# EAGLE design equaliser_TDA7418 (EAGLE 7.6.0)
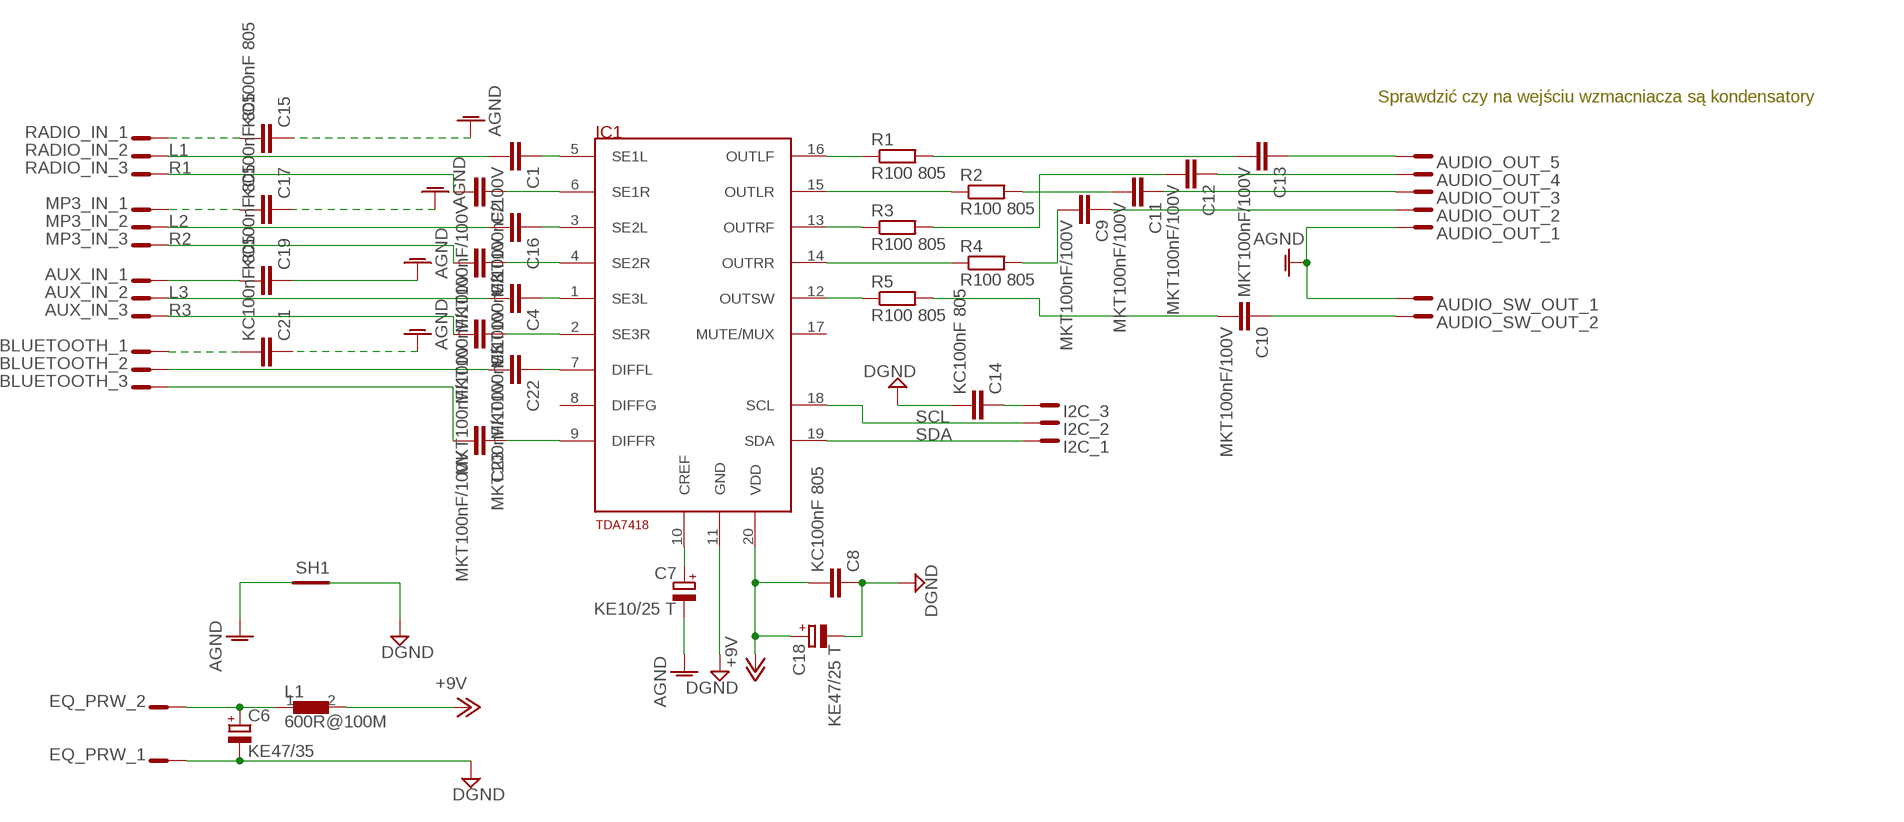
[diagram p0: schematic, sheet 1]

## Parts
AUDIO_OUT  JST_5_PIN_B5B-PH-KS  [B5B-PH-KS]
AUDIO_SW_OUT  JST_2_PIN_B2B-PH-KS  [B2B-PH-KS]
AUX_IN  JST_3_PIN_B3B-PH-KS  [B3B-PH-KS]
BLUETOOTH  JST_3_PIN_B3B-PH-KS  [B3B-PH-KS]
C1  MKT100nF/100V  C-EU050-035X075  [C050-035X075]
C2  MKT100nF/100V  C-EU050-035X075  [C050-035X075]
C3  MKT100nF/100V  C-EU050-035X075  [C050-035X075]
C4  MKT100nF/100V  C-EU050-035X075  [C050-035X075]
C5  MKT100nF/100V  C-EU050-035X075  [C050-035X075]
C6  KE47/35  CPOL-EUTT2D6  [TT2D6]
C7  KE10/25 T  CPOL-EUE1.8-4  [E1,8-4]
C8  KC100nF 805  C-EUC0805  [C0805]
C9  MKT100nF/100V  C-EU050-035X075  [C050-035X075]
C10  MKT100nF/100V  C-EU050-035X075  [C050-035X075]
C11  MKT100nF/100V  C-EU050-035X075  [C050-035X075]
C12  MKT100nF/100V  C-EU050-035X075  [C050-035X075]
C13  MKT100nF/100V  C-EU050-035X075  [C050-035X075]
C14  KC100nF 805  C-EUC0805  [C0805]
C15  KC100nF 805  C-EUC0805  [C0805]
C16  MKT100nF/100V  C-EU050-035X075  [C050-035X075]
C17  KC100nF 805  C-EUC0805  [C0805]
C18  KE47/25 T  CPOL-EUB45181B  [B45181B]
C19  KC100nF 805  C-EUC0805  [C0805]
C21  KC100nF 805  C-EUC0805  [C0805]
C22  MKT100nF/100V  C-EU050-035X075  [C050-035X075]
C23  MKT100nF/100V  C-EU050-035X075  [C050-035X075]
EQ_PRW  JST_2_PIN_B2B-XH-A  [B2B-XH-A]
I2C  JST_3_PIN_B3B-PH-KS  [B3B-PH-KS]
IC1  TDA7418  [SO20]
L1  600R@100M  FERRITR0805  [R0805]
MP3_IN  JST_3_PIN_B3B-PH-KS  [B3B-PH-KS]
R1  R100 805  R-EU_R0805  [R0805]
R2  R100 805  R-EU_R0805  [R0805]
R3  R100 805  R-EU_M0805  [M0805]
R4  R100 805  R-EU_M0805  [M0805]
R5  R100 805  R-EU_R0805  [R0805]
RADIO_IN  JST_3_PIN_B3B-PH-KS  [B3B-PH-KS]
SH1  SHORT-HT5  [SHORT_TOP-50]

## Nets
+9V0: C8.2 C18.+ IC1.20(VDD) L1.2 ; supply symbol labelled +9V
AGND: AUDIO_OUT.P$1 AUDIO_SW_OUT.P$1 C7.- C15.1 C17.1 C19.1 C21.1 SH1.1
DGND: C6.- C8.1 C14.2 C18.- EQ_PRW.P$1 IC1.11(GND) SH1.2
L1: C1.2 RADIO_IN.P$2
L2: C16.2 MP3_IN.P$2
L3: AUX_IN.P$2 C4.2
N$1: C6.+ EQ_PRW.P$2 L1.1
N$2: AUDIO_OUT.P$2 C9.1
N$3: C7.+ IC1.10(CREF)
N$4: C1.1 IC1.5(SE1L)
N$5: C2.1 IC1.6(SE1R)
N$6: C16.1 IC1.3(SE2L)
N$7: C3.1 IC1.4(SE2R)
N$8: C4.1 IC1.1(SE3L)
N$9: C5.1 IC1.2(SE3R)
N$10: C10.2 R5.2
N$11: AUDIO_SW_OUT.P$2 C10.1
N$12: IC1.16(OUTLF) R1.1
N$13: IC1.15(OUTLR) R2.1
N$14: C12.2 R3.2
N$15: C11.2 R2.2
N$16: IC1.13(OUTRF) R3.1
N$17: C9.2 R4.2
N$18: IC1.14(OUTRR) R4.1
N$19: IC1.12(OUTSW) R5.1
N$20: AUDIO_OUT.P$3 C11.1
N$21: AUDIO_OUT.P$4 C12.1
N$22: AUDIO_OUT.P$5 C13.1
N$23: C14.1 I2C.P$3
N$24: C15.2 RADIO_IN.P$1
N$25: C13.2 R1.2
N$26: C17.2 MP3_IN.P$1
N$27: AUX_IN.P$1 C19.2
N$29: BLUETOOTH.P$1 C21.2
N$30: C22.1 IC1.7(DIFFL)
N$31: C23.1 IC1.9(DIFFR)
N$32: BLUETOOTH.P$2 C22.2
N$33: BLUETOOTH.P$3 C23.2
R1: C2.2 RADIO_IN.P$3
R2: C3.2 MP3_IN.P$3
R3: AUX_IN.P$3 C5.2
SCL: I2C.P$2 IC1.18(SCL)
SDA: I2C.P$1 IC1.19(SDA)
Unconnected: IC1.8(DIFFG) IC1.17(MUTE/MUX)

## Notes on the sheet
- Sprawdzić czy na wejściu wzmacniacza są kondensatory

## Library data of the parts
AUDIO_OUT = conn-JST:JST_5_PIN_
AUDIO_SW_OUT EQ_PRW = conn-JST:JST_2_PIN_
AUX_IN BLUETOOTH I2C MP3_IN RADIO_IN = conn-JST:JST_3_PIN_
C1-C5 C8-C17 C19 C21-C23 = rcl:C-EU: CAPACITOR, European symbol
C6 C18 = rcl:CPOL-EU: POLARIZED CAPACITOR, European symbol
C7 = resistor:CPOL-EU: POLARIZED CAPACITOR, European symbol
IC1 = TDA7318_DIP:TDA7418; PACKAGE: SO20
L1 = ferrit_bear:FERRIT
R1-R5 = resistor:R-EU_: RESISTOR, European symbol
SH1 = shorts-old:SHORT-H: Short between two nets; BOM: no

## Board
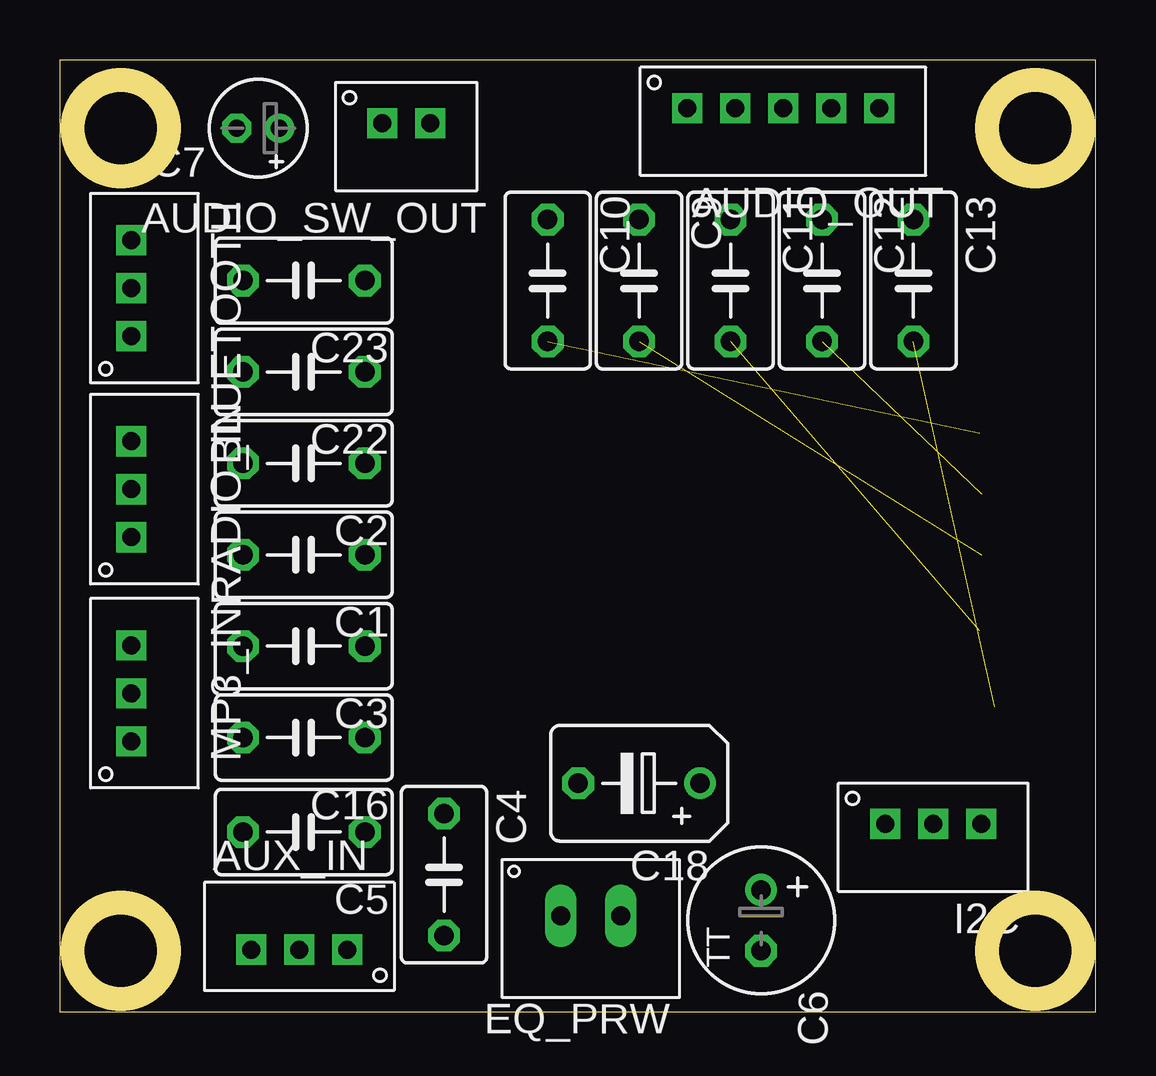
[diagram p1: board, top side]
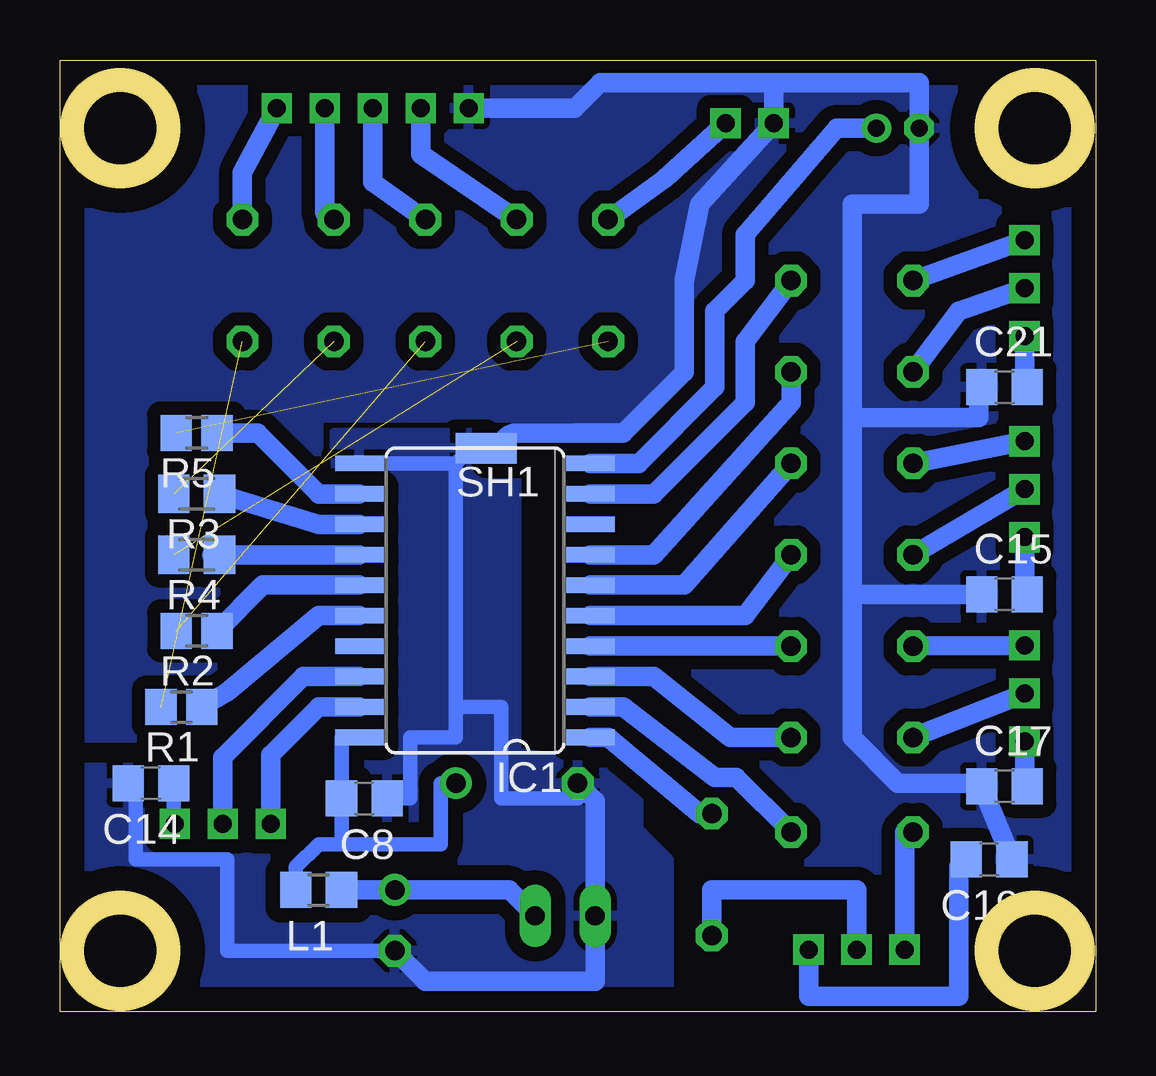
[diagram p2: board, bottom side, seen from below]

Size 43.16 x 39.68 mm. Coordinates in mm from the lower left corner, seen from the top.
Outline: 0,0 43.16,0 43.16,39.68 0,39.68 0,0
Outline: circle at 2.54,36.83 radius 2
Outline: circle at 40.64,36.83 radius 2
Outline: circle at 40.64,2.54 radius 2
Outline: circle at 2.54,2.54 radius 2
Copper layers (1*16): Top 0.035mm / dielectric 1.5mm / Bottom 0.035mm
Design rules "default": minimum track width 10mil, minimum drill 24mil, track to track 8mil, track to pad 8mil, pad to pad 8mil, via to via 8mil, smd to smd 8mil, copper to edge 40mil, drill to drill 8mil, minimum pad ring 10mil, minimum via ring 8mil, stop-mask expansion 4mil, vias tented up to drill 0mil, thermal gap 10mil

### Footprints (pad centres in the part's own frame; a part is rotated, then mirrored left to right if it is on the bottom)
B5B-PH-KS = drill 0.75 pad 1.2 square: P$1 -2,1.7; P$2 -4,1.7; P$3 -6,1.7; P$4 -8,1.7; P$5 -10,1.7
B2B-PH-KS = drill 0.75 pad 1.2 square: P$1 -2,1.7; P$2 -4,1.7
B3B-PH-KS = drill 0.75 pad 1.2 square: P$1 -2,1.7; P$2 -4,1.7; P$3 -6,1.7
C050-035X075 = drill 0.813 octagon: 1 -2.54,0; 2 2.54,0
TT2D6 = drill 0.813: + -1.27,0 | drill 0.813 octagon: - 1.27,0
E1,8-4 = drill 0.711 pad 1.168: + -0.889,0 | drill 0.711 pad 1.168 octagon: - 0.889,0
C0805 = smd 1.3 x 1.5: 1 -0.95,0; 2 0.95,0
B45181B = drill 0.813: + -2.54,0 | drill 0.813 octagon: - 2.54,0
B2B-XH-A = drill 0.8 long: P$1 -2.45,2.35; P$2 -4.95,2.35
SO20 = smd 0.66 x 2.032: 1 -4.445,-3.073; 2 -3.175,-3.073; 3 -1.905,-3.073; 4 -0.635,-3.073; 5 0.635,-3.073; 6 1.905,-3.073; 7 3.175,-3.073; 8 4.445,-3.073; 9 5.715,-3.073; 10 6.985,-3.073; 11 6.985,6.553; 12 5.715,6.553; 13 4.445,6.553; 14 3.175,6.553; 15 1.905,6.553; 16 0.635,6.553; 17 -0.635,6.553; 18 -1.905,6.553; 19 -3.175,6.553; 20 -4.445,6.553
R0805 = smd 1.3 x 1.5: 1 -0.95,0; 2 0.95,0
R0805' = smd 1.3 x 1.5: 1 -0.85,0; 2 0.85,0
M0805 = smd 1.3 x 1.6: 1 -0.95,0; 2 0.95,0
SHORT_TOP-50 = smd 1.27 x 1.27: 1 0.635,0; 2 -0.635,0

### Placement (x,y rotation side)
AUDIO_OUT  24.13,39.37 180 top
AUDIO_SW_OUT  11.43,38.73 180 top
AUX_IN  13.97,0.89 0 top
BLUETOOTH  1.27,26.16 270 top
C1  10.16,19.05 180 top
C2  10.16,22.86 180 top
C3  10.16,15.24 180 top
C4  16,5.72 270 top
C5  10.16,7.49 180 top
C6  29.21,3.81 270 top
C7  8.26,36.83 180 top
C8  30.48,8.89 180 bottom
C9  24.13,30.48 270 top
C10  20.32,30.48 270 top
C11  27.94,30.48 270 top
C12  31.75,30.48 270 top
C13  35.56,30.48 270 top
C14  39.37,9.52 180 bottom
C15  3.81,17.4 0 bottom
C16  10.16,11.43 180 top
C17  3.81,9.4 0 bottom
C18  24.13,9.52 180 top
C19  4.45,6.35 180 bottom
C21  3.81,26.04 0 bottom
C22  10.16,26.67 180 top
C23  10.16,30.48 180 top
EQ_PRW  18.41,6.35 180 top
I2C  32.38,9.52 180 top
IC1  24.13,15.88 90 bottom
L1  32.38,5.08 180 bottom
MP3_IN  1.27,9.27 270 top
R1  R100 805  [R0805']  38.1,12.7 180 bottom
R2  R100 805  [R0805']  37.47,15.88 180 bottom
R3  37.47,21.59 180 bottom
R4  37.47,19.05 180 bottom
R5  R100 805  [R0805']  37.47,24.13 180 bottom
RADIO_IN  1.27,17.78 270 top
SH1  25.4,23.49 0 bottom

### Tracks (layer width: path | path; a pad name or v marks a point on that pad's centre or on a via)
+9V0
  Bottom 0.61: IC1.20 31.43,11.43 C8.2 31.43,6.99 | C18.+ 27.3,9.52 27.3,6.99 31.43,6.99 | L1.2 33.34,6.03 32.38,6.99 31.43,6.99
AGND
  Bottom 0.254: 4.88,17.78 4.45,17.78 C15.1 | 4.45,26.67 C21.1
  Bottom 0.813: SH1.1 arc90 24.13,24.13 19.68,24.13 17.14,26.67 17.14,30.48 16.51,33.66 AUDIO_SW_OUT.P$1 13.43,38.73 | 13.43,38.73 20.64,38.73 21.71,37.67 AUDIO_OUT.P$1 | 13.43,38.73 7.37,38.73 C7.- 7.37,33.66 10.16,33.66 10.16,24.76 | 10.16,24.76 10.16,17.4 | 10.16,17.4 C15.1 | 10.16,24.76 4.88,24.76 4.88,26.04 C21.1 | 10.16,17.4 10.16,11.43 8.26,9.52 4.76,9.52 C17.1 C19.1
  pour Bottom (isolate 0.559): -0.63,-1.27 -0.63,33.66 5.08,33.66 5.08,40.64 43.18,40.64 43.18,11.43 32.38,11.43 32.38,24.76 21.59,24.76 21.59,12.06 18.41,12.06 18.41,8.25 17.14,6.99 17.14,-1.27
DGND
  Bottom 0.61: 26.67,22.86 SH1.2 | IC1.11 26.67,22.86 | 26.67,22.86 26.67,12.7 | 26.67,12.7 24.77,12.7 24.77,8.89 21.59,8.89 C18.- | C8.1 28.57,8.89 28.57,11.43 26.67,11.43 26.67,12.7 | C14.2 40.01,9.52 40.01,6.35 36.2,6.35 36.2,2.54 C6.-
  Bottom 0.813: C18.- 20.87,8.8 EQ_PRW.P$1 20.87,1.27 27.94,1.27 C6.-
  pour Bottom (isolate 0.61): 17.78,-1.27 17.78,6.35 19.05,7.62 19.05,10.16 24.13,10.79 24.13,24.13 31.75,24.13 31.11,10.16 43.18,10.16 43.18,-1.27
L1
  Bottom 0.813: RADIO_IN.P$2 C1.2
L2
  Bottom 0.813: MP3_IN.P$2 C16.2
L3
  Bottom 0.813: AUX_IN.P$2 9.97,5.08 16,5.08 C4.2
N$1
  Bottom 0.813: EQ_PRW.P$2 24.45,5.08 C6.+ L1.1
N$2
  Bottom 0.813: C9.1 28.13,35.75 AUDIO_OUT.P$2
N$3
  Bottom 0.813: IC1.10 19.05,22.86 15.88,26.04 15.88,29.21 14.61,30.48 14.61,32.39 10.79,36.83 C7.+
N$4
  Bottom 0.813: IC1.5 14.61,16.51 C1.1
N$5
  Bottom 0.813: IC1.6 17.14,17.78 C2.1
N$6
  Bottom 0.813: IC1.3 18.41,13.97 15.24,11.43 C16.1
N$7
  Bottom 0.813: IC1.4 C3.1
N$8
  Bottom 0.813: C4.1 16.51,8.25 20.32,11.43 IC1.1
N$9
  Bottom 0.813: IC1.2 19.68,12.7 15.88,9.78 14.99,9.78 C5.1
N$10  (1 unrouted)
N$11
  Bottom 0.813: C10.1 17.97,34.73 AUDIO_SW_OUT.P$2
N$12
  Bottom 0.813: IC1.16 32.38,16.51 36.2,13.33 R1.1
N$13
  Bottom 0.813: IC1.15 34.71,17.78 R2.1
N$14  (1 unrouted)
N$15  (1 unrouted)
N$16
  Bottom 0.813: IC1.13 32.38,20.32 R3.1
N$17  (1 unrouted)
N$18
  Bottom 0.813: IC1.14 R4.1 36.83,19.05
N$19
  Bottom 0.813: IC1.12 32.38,21.59 34.93,24.13 R5.1
N$20
  Bottom 0.813: C11.1 30.13,34.58 AUDIO_OUT.P$3
N$21
  Bottom 0.813: C12.1 arc90 32.13,33.4 AUDIO_OUT.P$4
N$22
  Bottom 0.813: AUDIO_OUT.P$5 35.56,34.97 C13.1
N$23
  Bottom 0.61: I2C.P$3 38.42,7.83 C14.1
N$24
  Bottom 0.813: C15.2 2.97,17.4 RADIO_IN.P$1
N$25  (1 unrouted)
N$26
  Bottom 0.813: C17.2 2.97,9.4 MP3_IN.P$1
N$27
  Bottom 0.813: AUX_IN.P$1 11.97,0.64 5.71,0.64 5.71,6.03 C19.2
N$29
  Bottom 0.813: C21.2 2.97,26.04 BLUETOOTH.P$1
N$30
  Bottom 0.813: IC1.7 18.41,19.05 12.7,25.4 C22.1
N$31
  Bottom 0.813: IC1.9 18.41,21.59 14.61,25.4 14.61,27.94 C23.1
N$32
  Bottom 0.813: BLUETOOTH.P$2 5.71,29.21 C22.2
N$33
  Bottom 0.813: BLUETOOTH.P$3 C23.2
R1
  Bottom 0.813: RADIO_IN.P$3 C2.2
R2
  Bottom 0.813: MP3_IN.P$3 C3.2
R3
  Bottom 0.813: AUX_IN.P$3 7.97,7.49 C5.2
SCL
  Bottom 0.813: IC1.18 33.02,13.97 36.38,10.61 I2C.P$2
SDA
  Bottom 0.813: IC1.19 32.38,12.7 34.38,10.7 I2C.P$1

### Text on the board
Document: SDA / SCL / GND
Descript: Sprawdzić czy na wejściu wzmacniacza są kondensatory